# Altium schematic sheet Motor Driver SCH 1.SchDoc
size A3
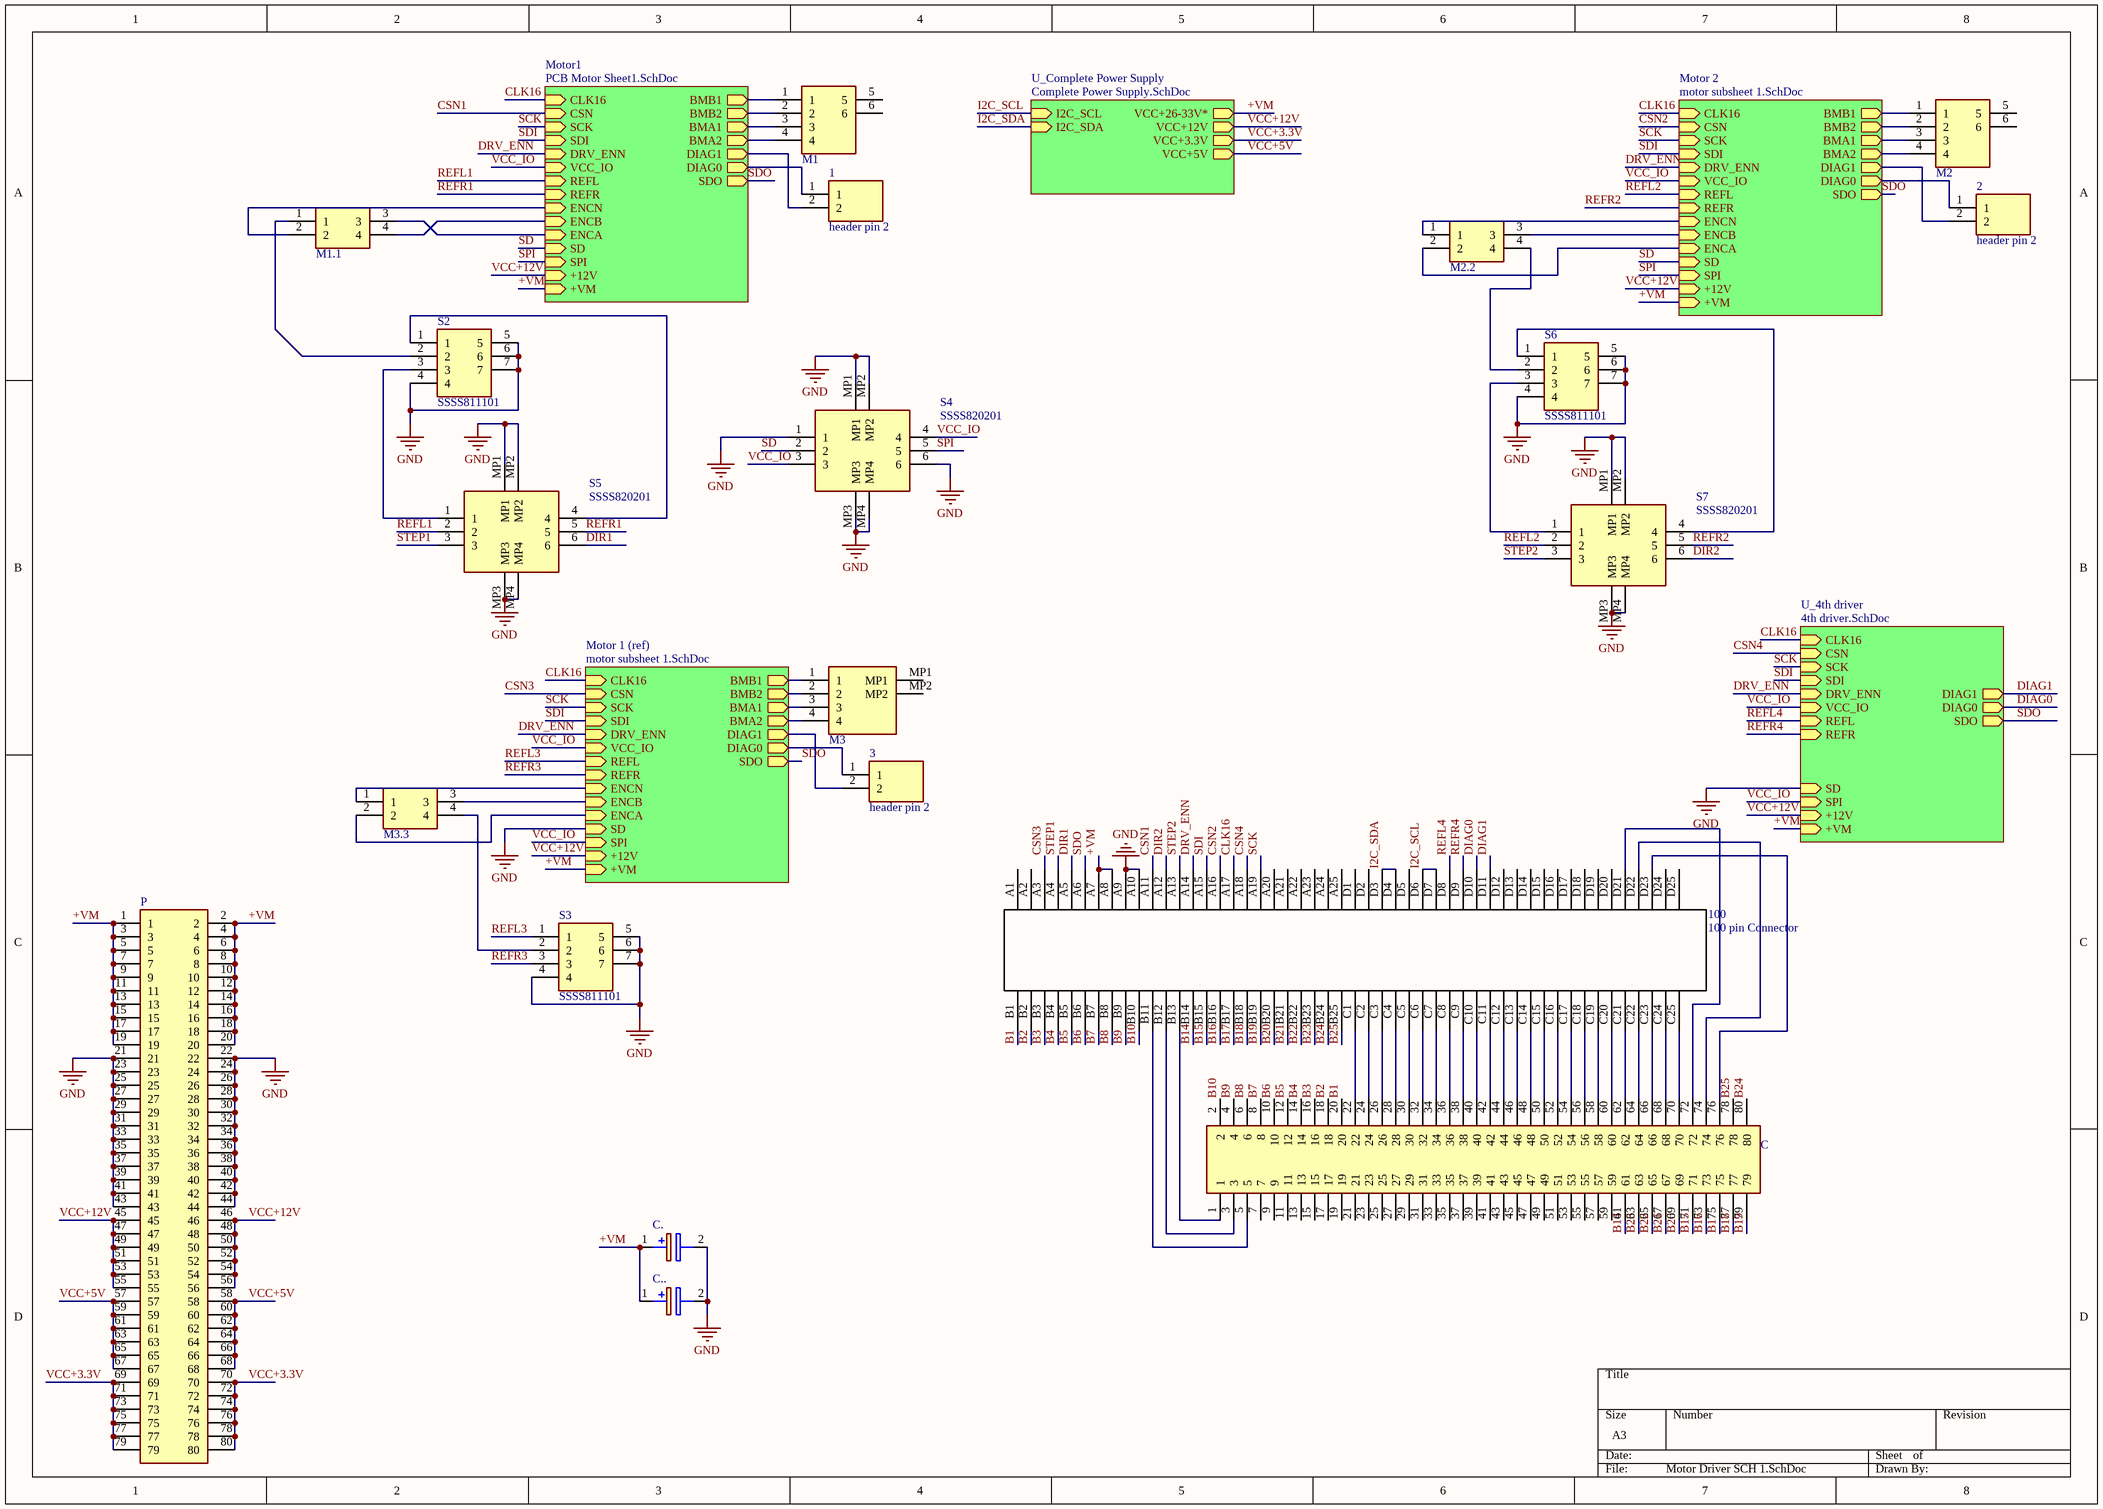
[diagram p0: Motor Driver SCH 1.SchDoc]

## Parts
1  header pin 2  [2 pin header]
2  header pin 2  [2 pin header]
3  header pin 2  [2 pin header]
100  100 pin Connector  [SAMTEC_FOLC-125-M1-L-Q-LC]
C  5-5179180-3  [551791803]  (value not drawn)
C.  TPSD476M035R0300V  [CAPPM7344X310N]  (value not drawn)
C..  TPSD476M035R0300V  [CAPPM7344X310N]  (value not drawn)
M1  1778780  [1778780]  (value not drawn)
M1.1  SM04B-XSRS-ETB_LF__SN_  [SM04B-XSRS-ETB_2]  (value not drawn)
M2  1778780  [1778780]  (value not drawn)
M2.2  SM04B-XSRS-ETB_LF__SN_  [SM04B-XSRS-ETB_2]  (value not drawn)
M3  BM04B-ACHSS-A-GAN-TF_LF__SN_  [BM04BACHSSAGANTFLFSN]  (value not drawn)
M3.3  SM04B-XSRS-ETB_LF__SN_  [SM04B-XSRS-ETB_2]  (value not drawn)
P  5-5179180-3  [551791803]  (value not drawn)
S2  SSSS811101  [SSSS811101]
S3  SSSS811101  [SSSS811101]
S4  SSSS820201  [SSSS820201]
S5  SSSS820201  [SSSS820201]
S6  SSSS811101  [SSSS811101]
S7  SSSS820201  [SSSS820201]

## Sub-sheets
Motor1 = PCB Motor Sheet1.SchDoc: BMB1 (out), BMB2 (out), BMA1 (out), BMA2 (out), DIAG1 (out), DIAG0 (out), SDO (out), CLK16 (in), CSN (in), SCK (in), SDI (in), DRV_ENN (in), VCC_IO (in), REFL (in), REFR (in), ENCN (in), ENCB (in), ENCA (in), SD (in), +12V (in), +VM (in), SPI (in)
Motor 1 (ref) = motor subsheet 1.SchDoc: BMB1 (out), BMB2 (out), BMA1 (out), BMA2 (out), DIAG1 (out), DIAG0 (out), SDO (out), CLK16 (in), CSN (in), SCK (in), SDI (in), DRV_ENN (in), VCC_IO (in), REFL (in), REFR (in), ENCN (in), ENCB (in), ENCA (in), SD (in), +12V (in), +VM (in), SPI (in)
Motor 2 = motor subsheet 1.SchDoc: BMB1 (out), BMB2 (out), BMA1 (out), BMA2 (out), DIAG1 (out), DIAG0 (out), SDO (out), CLK16 (in), CSN (in), SCK (in), SDI (in), DRV_ENN (in), VCC_IO (in), REFL (in), REFR (in), ENCN (in), ENCB (in), ENCA (in), SD (in), +12V (in), +VM (in), SPI (in)
U_4th driver = 4th driver.SchDoc: DIAG1 (out), DIAG0 (out), SDO (out), CLK16 (in), CSN (in), SCK (in), SDI (in), DRV_ENN (in), VCC_IO (in), REFL (in), REFR (in), SD (in), +12V (in), +VM (in), SPI (in)
U_Complete Power Supply = Complete Power Supply.SchDoc: VCC+26-33V* (out), VCC+12V (out), VCC+3.3V (out), VCC+5V (out), I2C_SCL (in), I2C_SDA (in)

## Nets
GND: 100.A9 100.A10 C..2(-) C...2(-) P.21 P.22 P.23 P.24 P.25 P.26 P.27 P.28 P.29 P.30 P.31 P.32 P.33 P.34 P.35 P.36 P.37 P.38 P.39 P.40 P.41 P.42 P.43 P.44 S2.4 S2.5 S2.6 S2.7 S3.4 S3.5 S3.6 S3.7 S4.1 S4.6 S4.MP1 S4.MP2 S4.MP3 S4.MP4 S5.MP1 S5.MP2 S5.MP3 S5.MP4 S6.4 S6.5 S6.6 S6.7 S7.MP1 S7.MP2 S7.MP3 S7.MP4 ; sheet U_4th driver/SD, sheet Motor 1 (ref)/SD
+VM: 100.A7 100.A8 C..1(+) C...1(+) P.1 P.2 P.3 P.4 P.5 P.6 P.7 P.8 P.9 P.10 P.11 P.12 P.13 P.14 P.15 P.16 P.17 P.18 P.19 P.20 ; sheet Motor1/+VM, sheet U_4th driver/+VM, sheet U_Complete Power Supply/VCC+26-33V*, sheet Motor 2/+VM, sheet Motor 1 (ref)/+VM
B1: 100.B1 C.20
B2: 100.B2 C.18
B3: 100.B3 C.16
B4: 100.B4 C.14
B5: 100.B5 C.12
B6: 100.B6 C.10
B7: 100.B7 C.8
B8: 100.B8 C.6
B9: 100.B9 C.4
B10: 100.B10 C.2
B14: 100.B14 C.61
B15: 100.B15 C.71
B16: 100.B16 C.73
B17: 100.B17 C.75
B18: 100.B18 C.77
B19: 100.B19 C.79
B20: 100.B20 C.69
B21: 100.B21 C.67
B22: 100.B22 C.65
B23: 100.B23 C.63
B24: 100.B24 C.80
B25: 100.B25 C.78
CLK16: 100.A17 ; sheet Motor1/CLK16, sheet U_4th driver/CLK16, sheet Motor 2/CLK16, sheet Motor 1 (ref)/CLK16
CSN1: 100.A11 ; sheet Motor1/CSN
CSN2: 100.A16 ; sheet Motor 2/CSN
CSN3: 100.A3 ; sheet Motor 1 (ref)/CSN
CSN4: 100.A18 ; sheet U_4th driver/CSN
DIAG0: 100.D10 ; sheet U_4th driver/DIAG0
DIAG1: 100.D11 ; sheet U_4th driver/DIAG1
DIR1: 100.A5 S5.6
DIR2: 100.A12 S7.6
DRV_ENN: 100.A14 ; sheet Motor1/DRV_ENN, sheet U_4th driver/DRV_ENN, sheet Motor 2/DRV_ENN, sheet Motor 1 (ref)/DRV_ENN
I2C_SCL: 100.D6 100.D7 ; sheet U_Complete Power Supply/I2C_SCL
I2C_SDA: 100.D3 100.D4 ; sheet U_Complete Power Supply/I2C_SDA
REFL1: S5.2 ; sheet Motor1/REFL
REFL2: S7.2 ; sheet Motor 2/REFL
REFL3: S3.1 ; sheet Motor 1 (ref)/REFL
REFL4: 100.D8 ; sheet U_4th driver/REFL
REFR1: S5.5 ; sheet Motor1/REFR
REFR2: S7.5 ; sheet Motor 2/REFR
REFR3: S3.3 ; sheet Motor 1 (ref)/REFR
REFR4: 100.D9 ; sheet U_4th driver/REFR
SCK: 100.A19 ; sheet Motor1/SCK, sheet U_4th driver/SCK, sheet Motor 2/SCK, sheet Motor 1 (ref)/SCK
SD: S4.2 ; sheet Motor1/SD, sheet Motor 2/SD
SDI: 100.A15 ; sheet Motor1/SDI, sheet U_4th driver/SDI, sheet Motor 2/SDI, sheet Motor 1 (ref)/SDI
SDO: 100.A6 ; sheet Motor1/SDO, sheet U_4th driver/SDO, sheet Motor 2/SDO, sheet Motor 1 (ref)/SDO
SPI: S4.5 ; sheet Motor1/SPI, sheet Motor 2/SPI
STEP1: 100.A4 S5.3
STEP2: 100.A13 S7.3
VCC+3.3V: P.69 P.70 P.71 P.72 P.73 P.74 P.75 P.76 P.77 P.78 P.79 P.80 ; sheet U_Complete Power Supply/VCC+3.3V
VCC+5V: P.57 P.58 P.59 P.60 P.61 P.62 P.63 P.64 P.65 P.66 P.67 P.68 ; sheet U_Complete Power Supply/VCC+5V
VCC+12V: P.45 P.46 P.47 P.48 P.49 P.50 P.51 P.52 P.53 P.54 P.55 P.56 ; sheet Motor1/+12V, sheet U_4th driver/+12V, sheet U_Complete Power Supply/VCC+12V, sheet Motor 2/+12V, sheet Motor 1 (ref)/+12V
VCC_IO: S4.3 S4.4 ; sheet Motor1/VCC_IO, sheet U_4th driver/VCC_IO, sheet U_4th driver/SPI, sheet Motor 2/VCC_IO, sheet Motor 1 (ref)/VCC_IO, sheet Motor 1 (ref)/SPI
Net1_1: 1.1 ; sheet Motor1/DIAG0
Net1_2: 1.2 ; sheet Motor1/DIAG1
Net2_1: 2.1 ; sheet Motor 2/DIAG0
Net2_2: 2.2 ; sheet Motor 2/DIAG1
Net3_1: 3.1 ; sheet Motor 1 (ref)/DIAG0
Net3_2: 3.2 ; sheet Motor 1 (ref)/DIAG1
Net100_B11: 100.B11 C.5
Net100_B12: 100.B12 C.3
Net100_B13: 100.B13 C.1
Net100_C1: 100.C1 C.22
Net100_C2: 100.C2 C.24
Net100_C3: 100.C3 C.26
Net100_C4: 100.C4 C.28
Net100_C5: 100.C5 C.30
Net100_C6: 100.C6 C.32
Net100_C7: 100.C7 C.34
Net100_C8: 100.C8 C.36
Net100_C9: 100.C9 C.38
Net100_C10: 100.C10 C.40
Net100_C11: 100.C11 C.42
Net100_C12: 100.C12 C.44
Net100_C13: 100.C13 C.46
Net100_C14: 100.C14 C.48
Net100_C15: 100.C15 C.50
Net100_C16: 100.C16 C.52
Net100_C17: 100.C17 C.54
Net100_C18: 100.C18 C.56
Net100_C19: 100.C19 C.58
Net100_C20: 100.C20 C.60
Net100_C21: 100.C21 C.62
Net100_C22: 100.C22 C.64
Net100_C23: 100.C23 C.66
Net100_C24: 100.C24 C.68
Net100_C25: 100.C25 C.70
Net100_D21: 100.D21 C.72
Net100_D22: 100.D22 C.74
Net100_D23: 100.D23 C.76
NetM1.1_1: M1.1.1 S2.2
NetM1.1_2: M1.1.2 ; sheet Motor1/ENCN
NetM1.1_3: M1.1.3 ; sheet Motor1/ENCA
NetM1.1_4: M1.1.4 ; sheet Motor1/ENCB
NetM1_1: M1.1 ; sheet Motor1/BMB1
NetM1_2: M1.2 ; sheet Motor1/BMB2
NetM1_3: M1.3 ; sheet Motor1/BMA1
NetM1_4: M1.4 ; sheet Motor1/BMA2
NetM2.2_1: M2.2.1 ; sheet Motor 2/ENCN
NetM2.2_2: M2.2.2 ; sheet Motor 2/ENCA
NetM2.2_3: M2.2.3 ; sheet Motor 2/ENCB
NetM2.2_4: M2.2.4 S6.2
NetM2_1: M2.1 ; sheet Motor 2/BMB1
NetM2_2: M2.2 ; sheet Motor 2/BMB2
NetM2_3: M2.3 ; sheet Motor 2/BMA1
NetM2_4: M2.4 ; sheet Motor 2/BMA2
NetM3.3_1: M3.3.1 ; sheet Motor 1 (ref)/ENCN
NetM3.3_2: M3.3.2 ; sheet Motor 1 (ref)/ENCA
NetM3.3_3: M3.3.3 ; sheet Motor 1 (ref)/ENCB
NetM3.3_4: M3.3.4 S3.2
NetM3_1: M3.1 ; sheet Motor 1 (ref)/BMB1
NetM3_2: M3.2 ; sheet Motor 1 (ref)/BMB2
NetM3_3: M3.3 ; sheet Motor 1 (ref)/BMA1
NetM3_4: M3.4 ; sheet Motor 1 (ref)/BMA2
NetS2_1: S2.1 S5.4
NetS2_3: S2.3 S5.1
NetS6_1: S6.1 S7.4
NetS6_3: S6.3 S7.1

Not connected (* = marked no-connect by the designer): 100 A1(26) A2(27) A20(45) A21(46) A22(47) A23(48) A24(49) A25(50) D1(101) D2(102) D5(105) D12(112) D13(113) D14(114) D15(115) D16(116) D17(117) D18(118) D19(119) D20(120) D24(124) D25(125); C 7 9 11 13 15 17 19 21 23 25 27 29 31 33 35 37 39 41 43 45 47 49 51 53 55 57 59; M1 5 6; M2 5 6; M3 MP1 MP2

## Library data of the parts
C P = 5-5179180-3: Connector; Manufacturer_Name: TE Connectivity; Datasheet Link: https://www.te.com/commerce/DocumentDelivery/DDEController?Action=showdoc&DocId=Customer+Drawing%7F5179180%7FD2%7Fpdf%7FEnglish%7FENG_CD_5179180_D2.pdf%7F5-5179180-3; Height: 8mm; Manufacturer_Part_Number: 5-5179180-3; Mouser Part Number: 571-5-5179180-3; Mouser Price/Stock: https://www.mouser.co.uk/ProductDetail/TE-Connectivity/5-5179180-3?qs=P2RFxj4culIYpw1CYdphOg%3D%3D; Arrow Part Number: 5-5179180-3; Arrow Price/Stock: https://www.arrow.com/en/products/5-5179180-3/te-connectivity
C. C.. = TPSD476M035R0300V: Capacitor Polarised; Manufacturer_Name: Kyocera AVX; Datasheet Link: https://componentsearchengine.com/Datasheets/2/TPSD476M035R0300V.pdf; Height: 3.1mm; Manufacturer_Part_Number: TPSD476M035R0300V; Mouser Part Number: 581-TPSD476M035R300V; Mouser Price/Stock: https://www.mouser.co.uk/ProductDetail/KYOCERA-AVX/TPSD476M035R0300V?qs=fAHHVMwC%252BbhHPnRCkY2ORg%3D%3D
M1 M2 = 1778780: Connector; Manufacturer_Name: Phoenix Contact; Datasheet Link: http://www.phoenixcontact.com/de/produkte/1778780/pdf; Height: 5.1mm; Manufacturer_Part_Number: 1778780; Mouser Part Number: 651-1778780; Mouser Price/Stock: https://www.mouser.co.uk/ProductDetail/Phoenix-Contact/1778780?qs=pYfYGt2amwkFYtacWTGMiw%3D%3D; Arrow Part Number: 1778780; Arrow Price/Stock: https://www.arrow.com/en/products/1778780/phoenix-contact?region=nac
M1.1 M2.2 M3.3 = SM04B-XSRS-ETB_LF__SN_: Connector; Manufacturer_Name: JST (JAPAN SOLDERLESS TERMINALS); Manufacturer_Part_Number: SM04B-XSRS-ETB(LF)(SN); Datasheet Link: https://datasheet.datasheetarchive.com/originals/distributors/Datasheets_SAMA/3d8b1bb9e73c0962bb93b166b87abb57.pdf
M3 = BM04B-ACHSS-A-GAN-TF_LF__SN_: Connector; Manufacturer_Name: JST (JAPAN SOLDERLESS TERMINALS); Manufacturer_Part_Number: BM04B-ACHSS-A-GAN-TF(LF)(SN); Datasheet Link: https://www.jst-mfg.com/product/pdf/eng/eACH.pdf; Height: 1.4mm
S2 S3 S6 = SSSS811101: Switch; Manufacturer_Name: ALPS Electric; Height: 1.6mm; Manufacturer_Part_Number: SSSS811101; Mouser Part Number: 688-SSSS811101; Mouser Price/Stock: https://www.mouser.co.uk/ProductDetail/Alps-Alpine/SSSS811101?qs=m0BA540hBPe%2FELmLcs%2FcCA%3D%3D; Arrow Part Number: SSSS811101; Arrow Price/Stock: https://www.arrow.com/en/products/ssss811101/alps-electric
S4 S5 S7 = SSSS820201: Switch; Manufacturer_Name: ALPS Electric; Datasheet Link: https://componentsearchengine.com/Datasheets/2/SSSS820201.pdf; Height: 2.9mm; Manufacturer_Part_Number: SSSS820201; Mouser Part Number: 688-SSSS820201; Mouser Price/Stock: https://www.mouser.co.uk/ProductDetail/Alps-Alpine/SSSS820201?qs=4nKZKRgDHlnI2QoAHm%252BpWA%3D%3D; Arrow Part Number: SSSS820201; Arrow Price/Stock: https://www.arrow.com/en/products/ssss820201/alps-electric?region=nac